# Altium schematic sheet NRF module for band.SchDoc: Title
size A4; Date: *******; ApprovedBy: *******; CheckedBy: None; Author: *******; CompanyName: *******; DrawnBy: Name; Engineer: *******; Organization: *******; Address1: *******; Address2: *******; Address3: *******; Address4: *******; DocumentNumber: Doc Num; Revision: *******; SheetNumber: 14; SheetTotal: 16; Subtitle: Subtitle; Project: Project; VersionRevision: VersionRevision; TotalSheet: TotalSheet; CurrentTime: *******; CurrentDate: *******; Time: *******; DocumentFullPathAndName: *******; DocumentName: *******; ModifiedDate: *******; ImagePath: *******; ProjectName: *******; Application_BuildNumber: *******
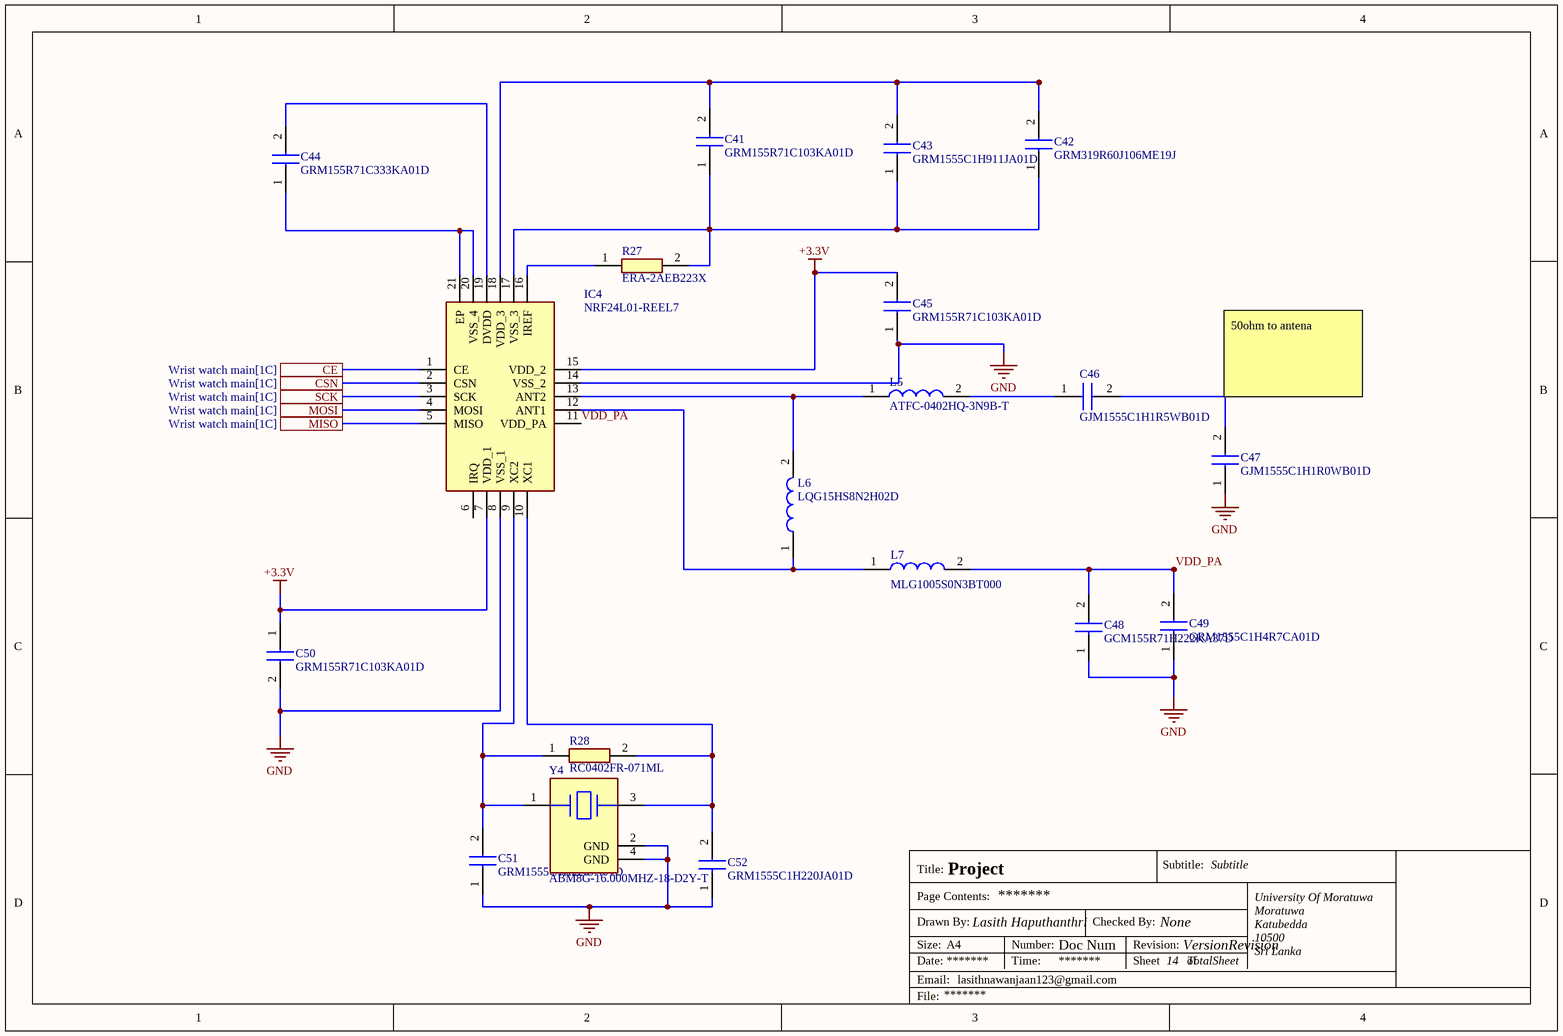
[diagram p0: NRF module for band.SchDoc]

## Parts
C41  GRM155R71C103KA01D  [CAPC1005X55N]
C42  GRM319R60J106ME19J  [CAPC3216X95N]
C43  GRM1555C1H911JA01D  [CAPC1005X55N]
C44  GRM155R71C333KA01D  [CAPC1005X55N]
C45  GRM155R71C103KA01D  [CAPC1005X55N]
C46  GJM1555C1H1R5WB01D  [CAPC1005X55N]
C47  GJM1555C1H1R0WB01D  [CAPC1005X55N]
C48  GCM155R71H222KA37D  [CAPC1005X55N]
C49  GRM1555C1H4R7CA01D  [CAPC1005X55N]
C50  GRM155R71C103KA01D  [CAPC1005X55N]
C51  GRM1555C1H220JA01D  [CAPC1005X55N]
C52  GRM1555C1H220JA01D  [CAPC1005X55N]
IC4  NRF24L01-REEL7  [QFN50P400X400X80-21N-D]
L5  ATFC-0402HQ-3N9B-T  [INDC1005X37N]
L6  LQG15HS8N2H02D  [LQG15WH0N7B02D]
L7  MLG1005S0N3BT000  [MLG1005]
R27  ERA-2AEB223X  [ERA2AED122X]
R28  RC0402FR-071ML  [RESC1005X40N]
Y4  ABM8G-16.000MHZ-18-D2Y-T  [FP-ABM8G-MFG]

## Ports
CE (see Wrist watch main[1C]), CSN (see Wrist watch main[1C]), MISO (see Wrist watch main[1C]), MOSI (see Wrist watch main[1C]), SCK (see Wrist watch main[1C])

## Nets
+3.3V: C45.2 C50.1 IC4.7(VDD_1) IC4.15(VDD_2)
GND: C45.1 C47.1 C48.1 C49.1 C50.2 C51.1 C52.1 IC4.8(VSS_1) IC4.14(VSS_2) Y4.2(GND) Y4.4(GND)
CE: IC4.1(CE) ; port CE
CSN: IC4.2(CSN) ; port CSN
MISO: IC4.5(MISO) ; port MISO
MOSI: IC4.4(MOSI) ; port MOSI
SCK: IC4.3(SCK) ; port SCK
VDD_PA: C48.2 C49.2 IC4.11(VDD_PA) L7.2
NetC41_1: C41.1 C42.1 C43.1 IC4.17(VSS_3) R27.2
NetC41_2: C41.2 C42.2 C43.2 IC4.18(VDD_3)
NetC44_1: C44.1 IC4.20(VSS_4) IC4.21(EP)
NetC44_2: C44.2 IC4.19(DVDD)
NetC46_1: C46.1 L5.2
NetC46_2: C46.2 C47.2
NetC51_2: C51.2 IC4.9(XC2) R28.1 Y4.1
NetC52_2: C52.2 IC4.10(XC1) R28.2 Y4.3
NetIC4_12: IC4.12(ANT1) L6.1 L7.1
NetIC4_13: IC4.13(ANT2) L5.1 L6.2
NetIC4_16: IC4.16(IREF) R27.1

Not connected (* = marked no-connect by the designer): IC4 6(IRQ)

## Notes on the sheet
- 50ohm to antena
- Title:
- Drawn By:
- Page Contents:
- Checked By:
- Subtitle:
- University Of Moratuwa
- Moratuwa
- Size:
- Date:
- File:
- Email:
- A4
- lasithnawanjaan123@gmail.com
- Lasith Haputhanthri
- Number:
- Time:
- Revision:
- Sheet
- of
- Katubedda
- 10500
- Sri Lanka

## Library data of the parts
C41 C45 C50 = GRM155R71C103KA01D: Capacitor; Manufacturer_Name: Murata Electronics; Datasheet Link: http://www.murata.com/~/media/webrenewal/support/library/catalog/products/capacitor/mlcc/c02e.pdf; Height: 0.55mm; Manufacturer_Part_Number: GRM155R71C103KA01D; Mouser Part Number: 81-GRM36X103K16; Mouser Price/Stock: https://www.mouser.co.uk/ProductDetail/Murata-Electronics/GRM155R71C103KA01D?qs=8YPuuxuUzMI%252B9QLnzeLwhQ%3D%3D; Arrow Part Number: GRM155R71C103KA01D; Arrow Price/Stock: https://www.arrow.com/en/products/grm155r71c103ka01d/murata-manufacturing?region=europe
C42 = GRM319R60J106ME19J: Capacitor; Manufacturer_Name: Murata Electronics; Datasheet Link: http://www.murata.com/~/media/webrenewal/support/library/catalog/products/capacitor/mlcc/c02e.pdf; Height: 0.95mm; Manufacturer_Part_Number: GRM319R60J106ME19J; Mouser Part Number: 81-GRM319R60J106ME9J; Mouser Price/Stock: https://www.mouser.co.uk/ProductDetail/Murata-Electronics/GRM319R60J106ME19J?qs=MY6wChARw2y3T227WLEMMA%3D%3D
C43 = GRM1555C1H911JA01D: Capacitor; Manufacturer_Name: Murata Electronics; Datasheet Link: http://www.murata.com/~/media/webrenewal/support/library/catalog/products/capacitor/mlcc/c02e.pdf; Height: 0.55mm; Manufacturer_Part_Number: GRM1555C1H911JA01D; Mouser Part Number: 81-GRM1555C1H911JA1D; Mouser Price/Stock: https://www.mouser.co.uk/ProductDetail/Murata-Electronics/GRM1555C1H911JA01D?qs=p6VZ%252BklCkRTpKNdGAzqH7g%3D%3D
C44 = GRM155R71C333KA01D: Capacitor; Manufacturer_Name: Murata Electronics; Datasheet Link: http://www.murata.com/~/media/webrenewal/support/library/catalog/products/capacitor/mlcc/c02e.pdf; Height: 0.55mm; Manufacturer_Part_Number: GRM155R71C333KA01D; Arrow Part Number: GRM155R71C333KA01D; Arrow Price/Stock: https://www.arrow.com/en/products/grm155r71c333ka01d/murata-manufacturing
C46 = GJM1555C1H1R5WB01D: Capacitor; Manufacturer_Name: Murata Electronics; Datasheet Link: https://psearch.en.murata.com/capacitor/product/GJM1555C1H1R5WB01%23.html; Height: 0.55mm; Manufacturer_Part_Number: GJM1555C1H1R5WB01D; Mouser Part Number: 81-GJM1555C1H1R5WB1D; Mouser Price/Stock: https://www.mouser.co.uk/ProductDetail/Murata-Electronics/GJM1555C1H1R5WB01D?qs=YLLXL5qGyDucsRPozQcunA%3D%3D; Arrow Part Number: GJM1555C1H1R5WB01D; Arrow Price/Stock: https://www.arrow.com/en/products/gjm1555c1h1r5wb01d/murata-manufacturing?region=nac
C47 = GJM1555C1H1R0WB01D: Capacitor; Manufacturer_Name: Murata Electronics; Datasheet Link: https://psearch.en.murata.com/capacitor/product/GJM1555C1H1R0WB01%23.html; Height: 0.55mm; Manufacturer_Part_Number: GJM1555C1H1R0WB01D; Mouser Part Number: 81-GJM1555C1H1R0WB1D; Mouser Price/Stock: https://www.mouser.co.uk/ProductDetail/Murata-Electronics/GJM1555C1H1R0WB01D?qs=YLLXL5qGyDtaruZHJwTPNg%3D%3D; Arrow Part Number: GJM1555C1H1R0WB01D; Arrow Price/Stock: https://www.arrow.com/en/products/gjm1555c1h1r0wb01d/murata-manufacturing?region=nac
C48 = GCM155R71H222KA37D: Capacitor; Manufacturer_Name: Murata Electronics; Datasheet Link: https://psearch.en.murata.com/capacitor/product/GCM155R71H222KA37%23.html; Height: 0.55mm; Manufacturer_Part_Number: GCM155R71H222KA37D; Mouser Part Number: 81-GCM155R71H222K37D; Mouser Price/Stock: https://www.mouser.co.uk/ProductDetail/Murata-Electronics/GCM155R71H222KA37D?qs=QDXoN8f0aYKEsLYYwicpIw%3D%3D; Arrow Part Number: GCM155R71H222KA37D; Arrow Price/Stock: https://www.arrow.com/en/products/gcm155r71h222ka37d/murata-manufacturing?region=nac
C49 = GRM1555C1H4R7CA01D: Capacitor; Manufacturer_Name: Murata Electronics; Datasheet Link: http://www.murata.com/~/media/webrenewal/support/library/catalog/products/capacitor/mlcc/c02e.pdf; Height: 0.55mm; Manufacturer_Part_Number: GRM1555C1H4R7CA01D; Mouser Part Number: 81-GRM1555C1H4R7CA1D; Mouser Price/Stock: https://www.mouser.co.uk/ProductDetail/Murata-Electronics/GRM1555C1H4R7CA01D?qs=4k9rjS6ZRl7tSQRzstyMVg%3D%3D; Arrow Part Number: GRM1555C1H4R7CA01D; Arrow Price/Stock: https://www.arrow.com/en/products/grm1555c1h4r7ca01d/murata-manufacturing
C51 C52 = GRM1555C1H220JA01D: Capacitor; Manufacturer_Name: Murata Electronics; Datasheet Link: http://www.murata.com/~/media/webrenewal/support/library/catalog/products/capacitor/mlcc/c02e.pdf; Height: 0.55mm; Manufacturer_Part_Number: GRM1555C1H220JA01D; Mouser Part Number: 81-GRM1555C1H220JA1D; Mouser Price/Stock: https://www.mouser.co.uk/ProductDetail/Murata-Electronics/GRM1555C1H220JA01D?qs=4k9rjS6ZRl6sPwaL%252BE1uDQ%3D%3D; Arrow Part Number: GRM1555C1H220JA01D; Arrow Price/Stock: https://www.arrow.com/en/products/grm1555c1h220ja01d/murata-manufacturing?region=nac
IC4 = NRF24L01-REEL7: Integrated Circuit; Manufacturer_Name: Nordic Semiconductor; Datasheet Link: https://4donline.ihs.com/images/VipMasterIC/IC/NRSA/NRSAS00020/NRSAS00020-1.pdf?hkey=EF798316E3902B6ED9A73243A3159BB0; Height: 0.8mm; Manufacturer_Part_Number: NRF24L01-REEL7; Mouser Part Number: 949-NRF24L01-REEL7; Mouser Price/Stock: https://www.mouser.co.uk/ProductDetail/Nordic-Semiconductor/nRF24L01-REEL7?qs=yd0qOhnSiDfNM3Q865kckA%3D%3D; Arrow Part Number: NRF24L01-REEL7; Arrow Price/Stock: null?region=nac
L5 = ATFC-0402HQ-3N9B-T: Inductor; Manufacturer_Name: ABRACON; Datasheet Link: https://abracon.com/Magnetics/inductors/ATFC-0402HQ.pdf; Height: 0.37mm; Manufacturer_Part_Number: ATFC-0402HQ-3N9B-T
L6 = LQG15HS8N2H02D: Inductor; Manufacturer_Name: Murata Electronics; Datasheet Link: https://psearch.en.murata.com/inductor/product/LQG15HS8N2H02%23.html; Height: 0.55mm; Manufacturer_Part_Number: LQG15HS8N2H02D; Mouser Part Number: 81-LQG15HS8N2H02D; Mouser Price/Stock: https://www.mouser.co.uk/ProductDetail/Murata-Electronics/LQG15HS8N2H02D?qs=60uY6ySkanTiptaknJqb2Q%3D%3D; Arrow Part Number: LQG15HS8N2H02D; Arrow Price/Stock: https://www.arrow.com/en/products/lqg15hs8n2h02d/murata-manufacturing
L7 = MLG1005S0N3BT000: Inductor; Manufacturer_Name: TDK; Datasheet Link: https://product.tdk.com/system/files/dam/doc/product/inductor/inductor/smd/catalog/inductor_commercial_high-frequency_mlg1005s_en.pdf; Manufacturer_Part_Number: MLG1005S0N3BT000; Mouser Part Number: 810-MLG1005S0N3BT000; Mouser Price/Stock: https://www.mouser.co.uk/ProductDetail/TDK/MLG1005S0N3BT000?qs=u4%252BEJ9urDASg1T%252BCePJhFw%3D%3D; Arrow Part Number: MLG1005S0N3BT000; Arrow Price/Stock: https://www.arrow.com/en/products/mlg1005s0n3bt000/tdk
R27 = ERA-2AEB223X: Resistor; Manufacturer_Name: Panasonic; Datasheet Link: http://industrial.panasonic.com/cdbs/www-data/pdf/RDM0000/AOA0000C307.pdf; Height: 0.4mm; Manufacturer_Part_Number: ERA-2AEB223X; Mouser Part Number: 667-ERA-2AEB223X; Mouser Price/Stock: https://www.mouser.co.uk/ProductDetail/Panasonic/ERA-2AEB223X?qs=YFwoyZoVY0gOqA4AmOyJ2g%3D%3D; Arrow Part Number: ERA-2AEB223X; Arrow Price/Stock: https://www.arrow.com/en/products/era2aeb223x/panasonic?region=europe
R28 = RC0402FR-071ML: Resistor; Manufacturer_Name: KEMET; Datasheet Link: http://www.yageo.com/documents/recent/PYu-RC0402_51_RoHS_L_6_r.pdf; Height: 0.4mm; Manufacturer_Part_Number: RC0402FR-071ML; Mouser Part Number: 603-RC0402FR-071ML; Mouser Price/Stock: https://www.mouser.co.uk/ProductDetail/YAGEO/RC0402FR-071ML?qs=V1yeUXFNrknfoI4987wfBQ%3D%3D
Y4 = CMP-2000-05039-3: Crystal 12MHz ±20ppm (Tol) ±30ppm (Stability) 18pF FUND 120Ω 4-Pin SMD T/R; Series Resistance: 120R; Max Operating Temperature: 85°C; Mount: Surface Mount; Width: 2.5mm; Series: ABM8G; Termination: SMD/SMT; Frequency Tolerance: 20ppm; Tolerance: 20ppm; Min Operating Temperature: -40°C; Operating Frequency: 12 MHz; Depth: 2.5mm; Load Capacitance: 18pF; Number of Pins: 4; Length: 3.2mm; Radiation Hardening: No; Frequency Stability: 30ppm; Height: 1mm; Packaging: Tape and Reel; Package Quantity: 1000; ESR (Equivalent Series Resistance): 120R; Lead Free: Lead Free; Frequency: 12MHz; Case/Package: CSMD